# Altium schematic sheet M4.SchDoc
size A
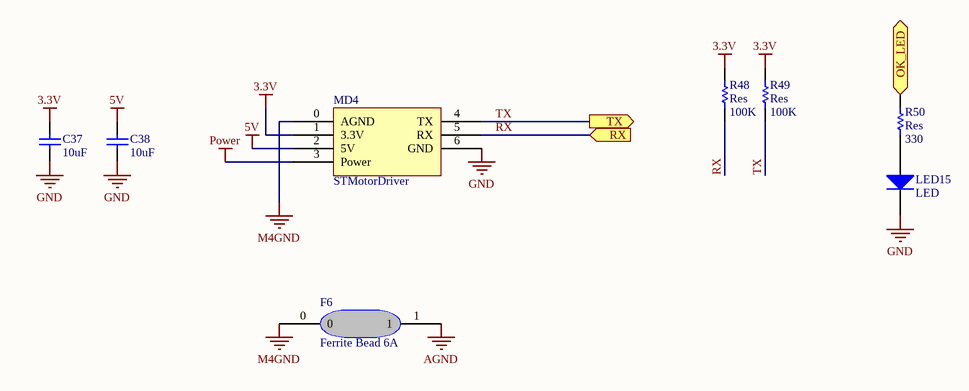
[diagram p0: M4.SchDoc]

## Parts
C37  value 10uF  [2012[0805]]  (hidden comment: Cap_UP)
C38  value 10uF  [2012[0805]]  (hidden comment: Cap_UP)
F6  Ferrite Bead 6A  [f6A]
LED15  LED  [2012[0805]]
MD4  STMotorDriver  [MotorDriver]
R48  Res  value 100K  [2012[0805]]
R49  Res  value 100K  [2012[0805]]
R50  Res  value 330  [2012[0805]]

## Ports
OK_LED (in), RX (in), TX (out)

## Nets
3.3V: C37.2 MD4.1(3.3V) R48.2 R49.2
5V: C38.2 MD4.2(5V)
AGND: F6.1
GND: C37.1 C38.1 LED15.2(K) MD4.6(GND)
M4GND: F6.0 MD4.0(AGND)
Power: MD4.3(Power)
OK_LED: R50.1 ; port OK_LED
RX: MD4.5(RX) R48.1 ; port RX
TX: MD4.4(TX) R49.1 ; port TX
NetLED15_1: LED15.1(A) R50.2

## Library data of the parts
C37 C38 = Cap_UP: Capacitor; Published: 8-Jun-2000; LatestRevisionDate: 17-Jul-2002; LatestRevisionNote: Re-released for DXP Platform.; PackageReference: RAD-0.3; Publisher: Altium Limited
F6 = F6A
LED15 = Diode: 1 Amp General Purpose Rectifier; Revision 1: 11-Jul-2000: SIM Model Added.; Revision 2: 17-Jul-2002: Re-released for DXP Platform.; Package Information: Latest Revision: Aug-1999; Code - JEDEC: DO-204-AL; Published: 8-Jun-2000; Datasheet: Latest Revision: 1998; Package Reference: DO-41; Publisher: Altium Limited
R48-R50 = Res: Semiconductor Resistor; Published: 8-Jun-2000; LatestRevisionDate: 17-Jul-2002; LatestRevisionNote: Re-released for DXP Platform.; PackageReference: AXIAL-0.5; Publisher: Altium Limited